# Altium schematic sheet blueduino-r2.SchDoc
size A4
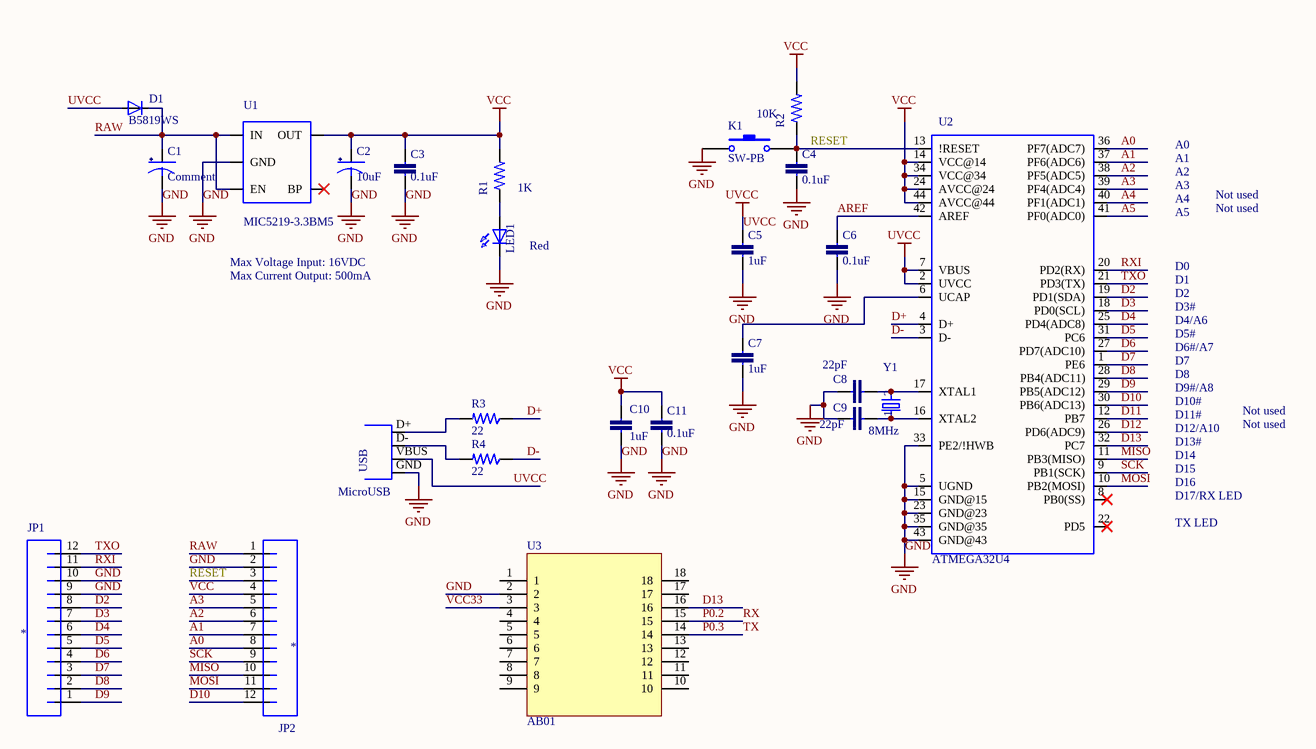
[diagram p0: blueduino-r2.SchDoc]

## Parts
C1  Comment  [0603C]
C2  10uF  [EIA3216]
C3  0.1uF  [0402-CAP]
C4  0.1uF  [0402-CAP]
C5  1uF  [0402-CAP]
C6  0.1uF  [0402-CAP]
C7  1uF  [0402-CAP]
C8  22pF  [0402-CAP]
C9  22pF  [0402-CAP]
C10  1uF  [0402-CAP]
C11  0.1uF  [0402-CAP]
D1  B5819WS  [SOD-323]
JP1  *  [1X12]
JP2  *  [1X12]
K1  SW-PB  [SPST-2]
LED1  Red  [LED-0603]
R1  1K  [0402-RES]
R2  10K  [0402-RES]
R3  22  [0402-RES]
R4  22  [0402-RES]
U1  MIC5219-3.3BM5  [SOT23-5]
U2  ATMEGA32U4  [QFN-44-NOPAD]
U3  AB01  [CC2540-MINI]
X1  MicroUSB  [USB-MICROB]
Y1  8MHz  [OSCCC250X320X80-4L]

## Nets
GND: C1.C(-) C2.C(-) C3.1 C4.1 C5.1 C6.1 C7.1 C8.2 C9.2 C10.2 C11.1 JP1.9 JP1.10 JP2.2 K1.1 LED1.C U1.2(GND) U2.5(UGND) U2.15(GND@15) U2.23(GND@23) U2.33(PE2/!HWB) U2.35(GND@35) U2.43(GND@43) U3.2 X1.GND
UVCC: C5.2 D1.2(A) U2.2(UVCC) U2.7(VBUS) X1.VBUS
VCC: C2.A(+) C3.2 C10.1 C11.2 JP2.4 R1.2 R2.2 U1.5(OUT) U2.14(VCC@14) U2.24(AVCC@24) U2.34(VCC@34) U2.44(AVCC@44)
A0: JP2.8 U2.36(PF7(ADC7))
A1: JP2.7 U2.37(PF6(ADC6))
A2: JP2.6 U2.38(PF5(ADC5))
A3: JP2.5 U2.39(PF4(ADC4))
A4: U2.40(PF1(ADC1))
A5: U2.41(PF0(ADC0))
AREF: C6.2 U2.42(AREF)
D2: JP1.8 U2.19(PD1(SDA))
D3: JP1.7 U2.18(PD0(SCL))
D4: JP1.6 U2.25(PD4(ADC8))
D5: JP1.5 U2.31(PC6)
D6: JP1.4 U2.27(PD7(ADC10))
D7: JP1.3 U2.1(PE6)
D8: JP1.2 U2.28(PB4(ADC11))
D9: JP1.1 U2.29(PB5(ADC12))
D10: JP2.12 U2.30(PB6(ADC13))
D11: U2.12(PB7)
D12: U2.26(PD6(ADC9))
D13: U2.32(PC7) U3.16
D+: R3.1 U2.4(D+)
D-: R4.1 U2.3(D-)
MISO: JP2.10 U2.11(PB3(MISO))
MOSI: JP2.11 U2.10(PB2(MOSI))
P0.2: U3.15  [also labelled RX]
P0.3: U3.14  [also labelled TX]
RAW: C1.A(+) D1.1(C) JP2.1 U1.1(IN) U1.3(EN)
RESET: C4.2 JP2.3 K1.2 R2.1 U2.13(!RESET)
RXI: JP1.11 U2.20(PD2(RX))
SCK: JP2.9 U2.9(PB1(SCK))
TXO: JP1.12 U2.21(PD3(TX))
VCC33: U3.3
NetC7_2: C7.2 U2.6(UCAP)
NetC8_1: C8.1 U2.17(XTAL1) Y1.3
NetC9_1: C9.1 U2.16(XTAL2) Y1.1
NetLED1_A: LED1.A R1.1
NetR3_2: R3.2 X1.D+
NetR4_2: R4.2 X1.D-

Not connected (* = marked no-connect by the designer): U1 4(BP)*; U2 8(PB0(SS))* 22(PD5)*; U3 1 4 5 6 7 8 9 10 11 12 13 17 18

## Notes on the sheet
- Not used
- Max Voltage Input: 16VDC
- Max Current Output: 500mA
- (in symbol ATMEGA32U4QFN2) A0; A1; A2; A3; A4; A5; D0; D1; D2; D3#; D4/A6; D5#; D6#/A7; D7; D8; D9#/A8; D10#; D11#; D12/A10; D13#; D14; D15; D16; D17/RX LED; TX LED
- (in symbol USB-MICROB) USB

## Library data of the parts
C1 C2 = CAP_POL1206
C3-C11 = CAP0402-CAP
D1 = DIODESOD
JP1 JP2 = M12PTH
K1 = SW-PB: Switch; Published: 24-Mar-1999; LatestRevisionDate: 17-Jul-2002; LatestRevisionNote: Re-released for DXP Platform.; PackageReference: SPST-2; Publisher: Altium Limited
LED1 = LED0603
R1-R4 = RESISTOR0402-RES
U1 = V_REG_LDOSMD
U2 = ATMEGA32U4QFN2
U3 = CC2541_S02: Header, 25-Pin; LatestRevisionDate: 17-Jul-2002; LatestRevisionNote: Re-released for DXP Platform.; Publisher: Altium Limited
X1 = USB-MICROB
Y1 = CRYSTAL5X3